# EAGLE design stm32_rf_pio (EAGLE 8.1.1)
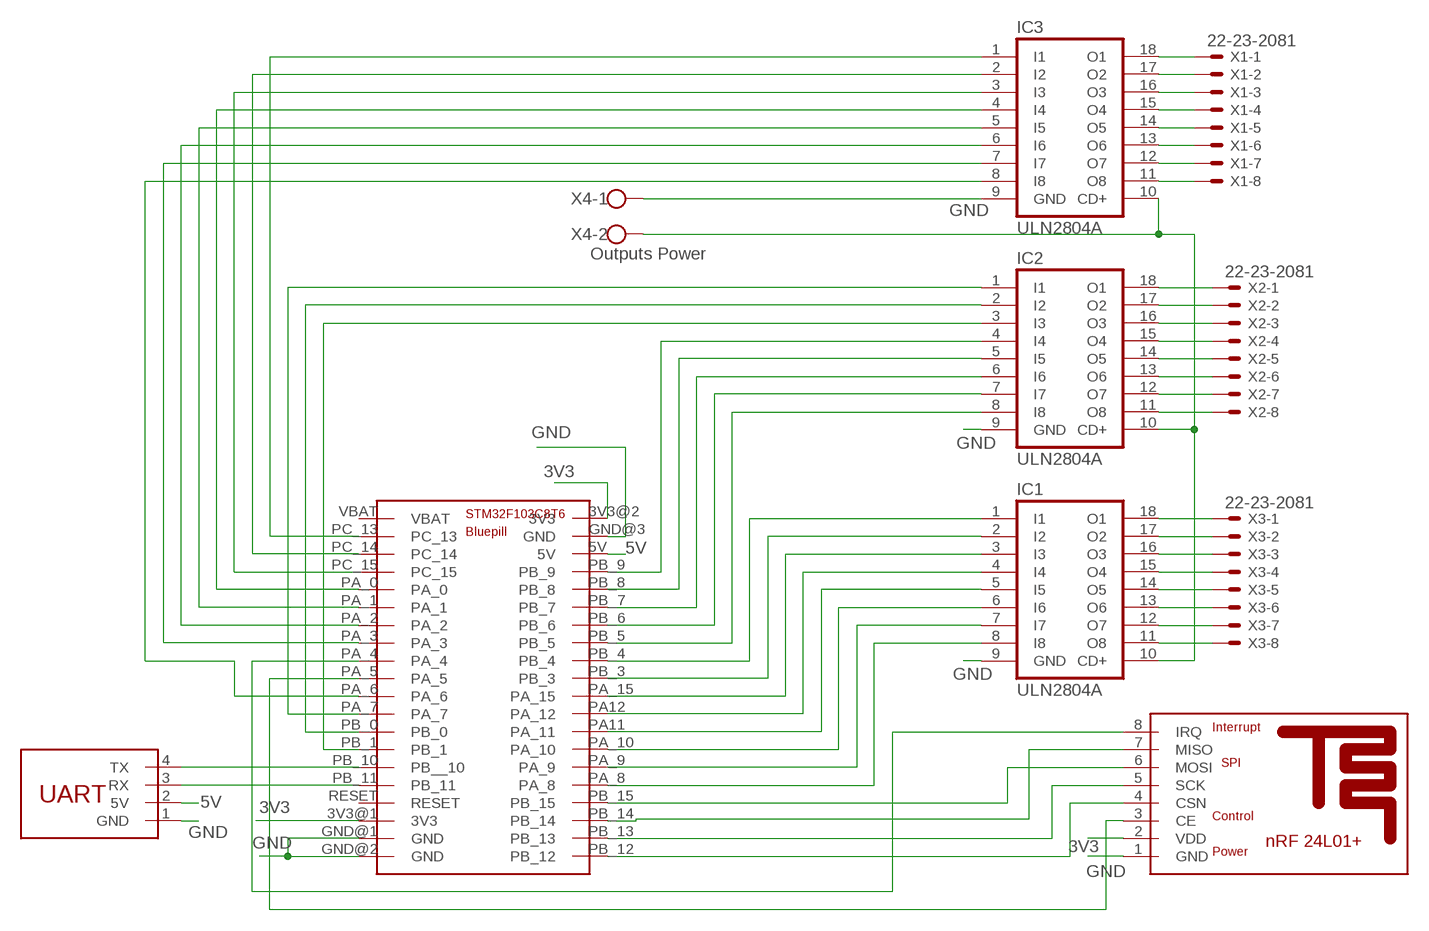
[diagram p0: schematic, sheet 1]

## Parts
IC1  ULN2804A  [DIL18]
IC2  ULN2804A  [DIL18]
IC3  ULN2804A  [DIL18]
U$1  STM32_BLUEPILL  [STM32_BLUEPILL]
U$2  NRF24L01+REFDESIGNMINI  [NRF24L01+REFDESIGN-MINI]
U$3  UARTMINI  [UART-MINI]
X1  22-23-2081  [22-23-2081]
X2  22-23-2081  [22-23-2081]
X3  22-23-2081  [22-23-2081]
X4  Outputs Power  W237-102  [W237-102]

## Nets
3V3: U$1.3V3@1(3V3) U$1.3V3@2(3V3) U$2.2(VDD)
5V: U$1.5V U$3.2(5V)
A12: IC1.4(I4) U$1.PA12(PA_12)
GND: IC1.9(GND) IC2.9(GND) IC3.9(GND) U$1.GND@1(GND) U$1.GND@2(GND) U$1.GND@3(GND) U$2.1(GND) U$3.1(GND) X4.1
HV: IC1.10(CD+) IC2.10(CD+) IC3.10(CD+) X4.2
M11: IC1.8(I8) U$1.PA_8
M12: IC1.7(I7) U$1.PA_9
M13: IC1.6(I6) U$1.PA_10
M14: IC1.5(I5) U$1.PA11(PA_11)
M21: IC1.3(I3) U$1.PA_15
M22: IC1.2(I2) U$1.PB_3
M23: IC3.6(I6) U$1.PA_2
M24: IC3.7(I7) U$1.PA_3
M31: IC1.1(I1) U$1.PB_4
M32: IC2.8(I8) U$1.PB_5
M33: IC2.2(I2) U$1.PB_0
M34: IC2.3(I3) U$1.PB_1
N$1: U$1.PB_12 U$2.4(CSN)
N$2: U$1.PB_13 U$2.5(SCK)
N$3: U$1.PB_14 U$2.7(MISO)
N$4: U$1.PB_15 U$2.6(MOSI)
N$14: IC2.7(I7) U$1.PB_6
N$15: IC2.6(I6) U$1.PB_7
N$16: IC2.5(I5) U$1.PB_8
N$17: IC2.4(I4) U$1.PB_9
N$20: IC2.1(I1) U$1.PA_7
N$21: IC3.18(O1) X1.1
N$22: IC3.17(O2) X1.2
N$23: IC3.16(O3) X1.3
N$24: IC3.4(I4) U$1.PA_0
N$25: IC3.5(I5) U$1.PA_1
N$28: IC3.8(I8) U$1.PA_6
N$29: IC3.1(I1) U$1.PC_13
N$30: IC3.2(I2) U$1.PC_14
N$31: IC3.3(I3) U$1.PC_15
N$32: IC3.15(O4) X1.4
N$33: IC3.14(O5) X1.5
N$34: IC3.13(O6) X1.6
N$35: IC3.12(O7) X1.7
N$36: IC3.11(O8) X1.8
N$37: IC2.18(O1) X2.1
N$38: IC2.17(O2) X2.2
N$39: IC2.16(O3) X2.3
N$40: IC2.15(O4) X2.4
N$41: IC2.14(O5) X2.5
N$42: IC2.13(O6) X2.6
N$43: IC2.12(O7) X2.7
N$44: IC2.11(O8) X2.8
N$45: IC1.18(O1) X3.1
N$46: IC1.17(O2) X3.2
N$47: IC1.16(O3) X3.3
N$48: IC1.15(O4) X3.4
N$49: IC1.14(O5) X3.5
N$50: IC1.13(O6) X3.6
N$51: IC1.12(O7) X3.7
N$52: IC1.11(O8) X3.8
N$54: U$1.PA_4 U$2.8(IRQ)
N$55: U$1.PA_5 U$2.3(CE)
N$56: U$1.PB_10(PB__10) U$3.4(TX)
N$57: U$1.PB_11 U$3.3(RX)
Unconnected: U$1.RESET U$1.VBAT

## Library data of the parts
IC1-IC3 = uln-udn:ULN2804A: DRIVER ARRAY
U$1 = stm32_bluepill:STM32_BLUEPILL
U$2 = nRF24L01+RefDesign:NRF24L01+REFDESIGN
U$3 = WFConnectors:UART
X1-X3 = con-molex:22-23-2081: .100" (2.54mm) Center Header - 8 Pin; MF: MOLEX; MPN: 22-23-2081; OC_FARNELL: 1756826; OC_NEWARK: 01C7592
X4 = con-wago-500:W237-102: WAGO SCREW CLAMP; MPN: 237-102; OC_FARNELL: unknown; OC_NEWARK: 70K9898

## Board
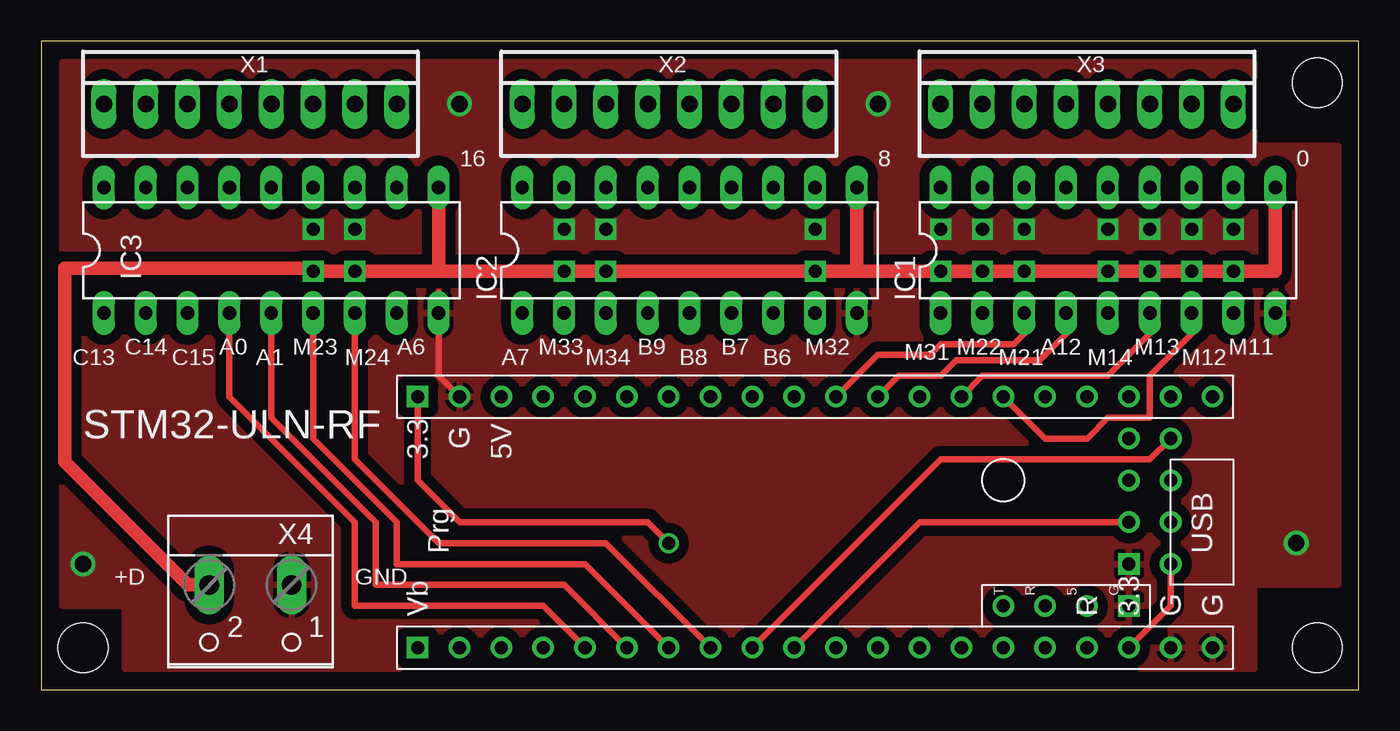
[diagram p1: board, top side]
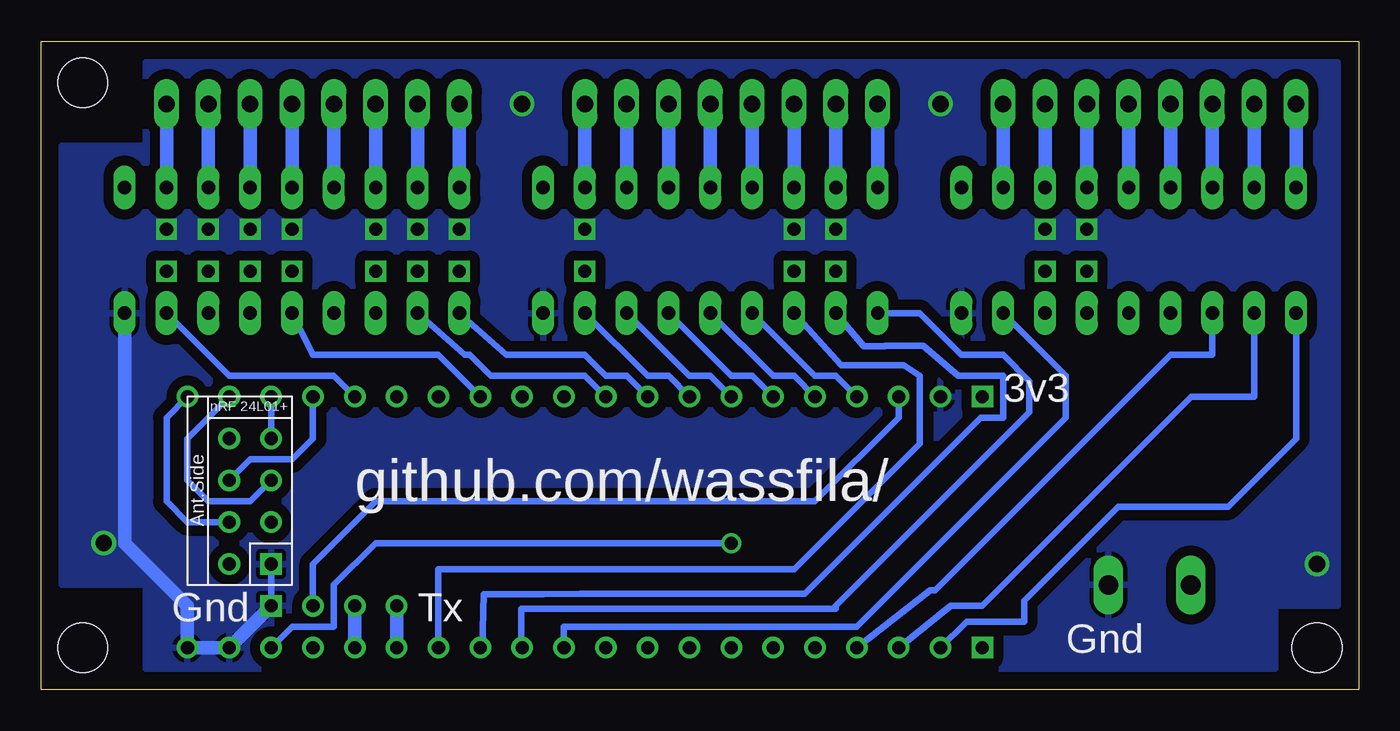
[diagram p2: board, bottom side, seen from below]

Size 80 x 39.37 mm. Coordinates in mm from the lower left corner, seen from the top.
Outline: 0,0 80,0 80,39.37 0,39.37 0,0
Copper layers (1*16): Top 0.035mm / dielectric 1.5mm / Bottom 0.035mm
Design rules "EagleRules": minimum track width 7mil, minimum drill 12mil, track to track 7mil, track to pad 7mil, pad to pad 7mil, via to via 7mil, smd to smd 0mil, copper to edge 20mil, drill to drill 10mil, minimum pad ring 10mil, minimum via ring 6mil, stop-mask expansion 2mil, vias tented up to drill 25mil, thermal gap 10mil
Holes 3 mm at 77.47,2.54 77.47,36.83 2.54,2.54

### Footprints (pad centres in the part's own frame; a part is rotated, then mirrored left to right if it is on the bottom)
DIL18 = drill 0.813 long: 1 -10.16,-3.81; 2 -7.62,-3.81; 3 -5.08,-3.81; 4 -2.54,-3.81; 5 0,-3.81; 6 2.54,-3.81; 7 5.08,-3.81; 8 7.62,-3.81; 9 10.16,-3.81; 10 10.16,3.81; 11 7.62,3.81; 12 5.08,3.81; 13 2.54,3.81; 14 0,3.81; 15 -2.54,3.81; 16 -5.08,3.81; 17 -7.62,3.81; 18 -10.16,3.81
STM32_BLUEPILL = drill 0.8: 3V3@1 -7.62,-19.05; 5V 7.62,19.05; GND@1 -7.62,-21.59; GND@2 -7.62,-24.13; GND@3 7.62,21.59; PA11 7.62,-6.35; PA12 7.62,-3.81; PA_0 -7.62,13.97; PA_1 -7.62,11.43; PA_2 -7.62,8.89; PA_3 -7.62,6.35; PA_4 -7.62,3.81; PA_5 -7.62,1.27; PA_6 -7.62,-1.27; PA_7 -7.62,-3.81; PA_8 7.62,-13.97; PA_9 7.62,-11.43; PA_10 7.62,-8.89; PA_15 7.62,-1.27; PB_0 -7.62,-6.35; PB_1 -7.62,-8.89; PB_3 7.62,1.27; PB_4 7.62,3.81; PB_5 7.62,6.35; PB_6 7.62,8.89; PB_7 7.62,11.43; PB_8 7.62,13.97; PB_9 7.62,16.51; PB_10 -7.62,-11.43; PB_11 -7.62,-13.97; PB_12 7.62,-24.13; PB_13 7.62,-21.59; PB_14 7.62,-19.05; PB_15 7.62,-16.51; PC_13 -7.62,21.59; PC_14 -7.62,19.05; PC_15 -7.62,16.51; RESET -7.62,-16.51 | drill 0.8 square: 3V3@2 7.62,24.13; VBAT -7.62,24.13
NRF24L01+REFDESIGN-MINI = drill 0.8 square: 1 -1.27,3.81 | drill 0.8: 2 1.27,3.81; 3 -1.27,1.27; 4 1.27,1.27; 5 -1.27,-1.27; 6 1.27,-1.27; 7 -1.27,-3.81; 8 1.27,-3.81
UART-MINI = drill 0.8 square: 1 0,0 | drill 0.8: 2 0,2.54; 3 0,5.08; 4 0,7.62
22-23-2081 = drill 1 long: 1 -8.89,0; 2 -6.35,0; 3 -3.81,0; 4 -1.27,0; 5 1.27,0; 6 3.81,0; 7 6.35,0; 8 8.89,0
W237-102 = drill 1.194 long: 1 -2.5,-1.27; 2 2.5,-1.27

### Placement (x,y rotation side)
IC1  64.77,26.67 0 top
IC2  39.37,26.67 0 top
IC3  13.97,26.67 0 top
U$1  46.99,10.16 90 top
U$2  67.31,11.43 180 bottom
U$3  66.04,5.08 90 top
X1  12.7,35.56 0 top
X2  38.1,35.56 0 top
X3  63.5,35.56 0 top
X4  12.7,5.08 180 top

### Tracks (layer width: path | path; a pad name or v marks a point on that pad's centre or on a via)
3V3  (via drill 0.8)
  Top 0.406: v38.1,8.89 36.83,10.16 25.4,10.16 22.86,12.7 U$1.3V3@2 | U$1.3V3@1 68.58,5.08 U$2.2
  Bottom 0.406: U$1.3V3@1 64.77,3.81 62.23,3.81 62.23,6.35 59.69,8.89 v38.1,8.89
5V
  Bottom 0.406: U$3.2 63.5,7.62 59.69,11.43 33.02,11.43 27.94,16.51 U$1.5V
A12
  Top 0.406: U$1.PA12 52.07,19.05 54.61,19.05 55.56,20 60.64,20 62.23,21.59 IC1.4
GND  (via drill 0.8 pad 1.27, 1)
  Top 0.406: U$1.GND@3 24.13,19.05 IC3.9 24.13,24.13
  Bottom 0.406: U$3.1 U$2.1
  Bottom 0.813: U$3.1 U$1.GND@1 U$1.GND@2 71.12,5.08 74.93,8.89 IC1.9
  other vias: 25.4,35.56 50.8,35.56 2.54,7.62 76.2,8.89 16.51,27.94 19.05,27.94 31.75,27.94 34.29,27.94 46.99,27.94 54.61,27.94 57.15,27.94 59.69,27.94 64.77,27.94 67.31,27.94 69.85,27.94 72.39,27.94
  pour Bottom (isolate 0.61): 1.27,38.1 73.66,38.1 73.66,33.02 78.74,33.02 78.74,6.35 73.66,6.35 73.66,1.27 5.08,1.27 5.08,5.08 1.27,5.08
  pour Top (isolate 0.61): 1.27,38.1 73.66,38.1 73.66,33.02 78.74,33.02 78.74,6.35 73.66,6.35 73.66,1.27 5.08,1.27 5.08,5.08 1.27,5.08
HV  (via drill 0.8 pad 1.27)
  Top 0.406: IC3.10 24.13,27.94 | IC2.10 49.53,27.94 | IC1.10 74.93,27.94
  Top 0.813: X4.2 8.89,6.35 1.42,13.82 1.42,25.57 16.34,25.57 v16.51,25.4 v19.05,25.4 24.13,25.4 | 24.13,25.4 IC3.10 | 24.13,25.4 v31.75,25.4 v34.29,25.4 v46.99,25.4 49.53,25.4 | 49.53,25.4 IC2.10 | 49.53,25.4 v54.61,25.4 v57.15,25.4 v59.69,25.4 v64.77,25.4 v67.31,25.4 v69.85,25.4 v72.39,25.4 74.93,25.4 IC1.10
M11
  Bottom 0.406: U$1.PA_8 62.23,19.05 68.58,19.05 IC1.8
M12
  Top 0.406: U$1.PA_9 60.96,15.24 63.5,15.24 64.77,16.51 67.31,16.51 67.31,19.05 69.85,21.59 IC1.7
M13
  Top 0.406: U$1.PA_10 57.15,19.05 64.77,19.05 67.31,21.59 IC1.6
M14
  Bottom 0.406: U$1.PA11 55.88,20.32 63.5,20.32 IC1.5
M21
  Top 0.406: U$1.PA_15 50.8,20.32 53.98,20.32 54.61,20.95 59.05,20.95 59.69,21.59 IC1.3
M22
  Bottom 0.406: U$1.PB_3 46.99,19.05 52.7,19.05 53.98,20.32 54.29,20.32 IC1.2
M23
  Top 0.406: U$1.PA_2 33.02,7.62 21.59,7.62 21.59,10.16 16.51,15.24 IC3.6
M24
  Top 0.406: U$1.PA_3 34.29,8.89 24.13,8.89 19.05,13.97 IC3.7
M31
  Bottom 0.406: U$1.PB_4 44.45,19.05 45.72,19.05 46.99,20.32 51.75,20.32 IC1.1
M32
  Bottom 0.406: U$1.PB_5 41.91,19.05 43.18,19.05 IC2.8
M33
  Bottom 0.406: U$1.PB_0 53.22,2.54 53.13,5.8 49.52,5.8 47.28,5.81 33.66,5.81 22.95,16.51 21.59,16.51 21.59,19.05 24.32,19.05 26.45,20.86 28.76,20.86 28.78,20.84 30.05,20.84 IC2.2
M34
  Bottom 0.406: U$1.PB_1 55.88,7.3 34.29,7.3 26.67,14.92 26.67,19.05 27.62,19.68 31.43,19.68 IC2.3
N$1
  Bottom 0.406: U$1.PB_12 72.39,16.51 72.39,11.43 71.12,10.16 U$2.4
N$2
  Bottom 0.406: U$1.PB_13 71.12,15.24 71.12,12.7 69.85,11.43 67.31,11.43 U$2.5
N$3
  Bottom 0.406: U$1.PB_14 U$2.7
N$4
  Bottom 0.406: U$1.PB_15 63.5,15.24 64.77,13.97 67.31,13.97 U$2.6
N$14
  Bottom 0.406: U$1.PB_6 39.37,19.05 40.64,19.05 IC2.7
N$15
  Bottom 0.406: U$1.PB_7 36.83,19.05 38.1,19.05 IC2.6
N$16
  Bottom 0.406: U$1.PB_8 34.29,19.05 35.56,19.05 IC2.5
N$17
  Bottom 0.406: U$1.PB_9 31.75,19.05 33.02,19.05 IC2.4
N$20
  Bottom 0.406: IC2.1 26.67,22.86 24.13,20.32 21.59,20.32 20,18.73 20,16.83 31.75,5.08 31.75,4.91 50.85,4.91 50.85,2.54 U$1.PA_7
N$21
  Bottom 0.813: X1.1 IC3.18
N$22
  Bottom 0.813: X1.2 IC3.17
N$23
  Bottom 0.813: X1.3 IC3.16
N$24
  Top 0.406: U$1.PA_0 30.48,5.08 19.05,5.08 19.05,10.16 11.43,17.78 IC3.4
N$25
  Top 0.406: U$1.PA_1 31.75,6.35 20.32,6.35 20.32,10.16 13.97,16.51 IC3.5
N$28
  Bottom 0.406: U$1.PA_6 48.26,3.81 30.48,3.81 17.78,16.51 17.78,19.05 IC3.8
N$29
  Bottom 0.406: U$1.PC_13 23.81,4.13 20.32,4.13 20.32,5.4 14.61,11.11 7.94,11.11 3.81,15.24 IC3.1
N$30
  Bottom 0.406: U$1.PC_14 24.77,5.08 22.86,5.08 10.16,17.78 6.35,17.78 IC3.2
N$31
  Bottom 0.406: U$1.PC_15 26.04,6.03 25.72,6.03 11.43,20.32 8.89,20.32 IC3.3
N$32
  Bottom 0.813: X1.4 IC3.15
N$33
  Bottom 0.813: X1.5 IC3.14
N$34
  Bottom 0.813: X1.6 IC3.13
N$35
  Bottom 0.813: X1.7 IC3.12
N$36
  Bottom 0.813: X1.8 IC3.11
N$37
  Bottom 0.813: X2.1 IC2.18
N$38
  Bottom 0.813: X2.2 IC2.17
N$39
  Bottom 0.813: X2.3 IC2.16
N$40
  Bottom 0.813: X2.4 IC2.15
N$41
  Bottom 0.813: X2.5 IC2.14
N$42
  Bottom 0.813: X2.6 IC2.13
N$43
  Bottom 0.813: X2.7 IC2.12
N$44
  Bottom 0.813: X2.8 IC2.11
N$45
  Bottom 0.813: X3.1 IC1.18
N$46
  Bottom 0.813: X3.2 IC1.17
N$47
  Bottom 0.813: X3.3 IC1.16
N$48
  Bottom 0.813: X3.4 IC1.15
N$49
  Bottom 0.813: X3.5 IC1.14
N$50
  Bottom 0.813: X3.6 IC1.13
N$51
  Bottom 0.813: X3.7 IC1.12
N$52
  Bottom 0.813: X3.8 IC1.11
N$54
  Top 0.406: U$1.PA_4 54.61,13.97 67.31,13.97 U$2.8
N$55
  Top 0.406: U$1.PA_5 53.34,10.16 U$2.3
N$56
  Bottom 0.813: U$1.PB_10 U$3.4
N$57
  Bottom 0.813: U$3.3 U$1.PB_11

### Text on the board
tPlace: 16 | 8 | 0 | C13 | C14 | C15 | A0 | A1 | M23 | M24 | A6 | A7 | M33 | M34 | B9 | B8 | B7 | B6 | M32 | M31 | M22 | M21 | A12 | M14 | M13 | M12 | M11 | STM32-ULN-RF | +D | GND
bPlace: 3v3 | github.com/wassfila/ | Tx | Gnd | Gnd